# EAGLE design tester (EAGLE 7.6.0)
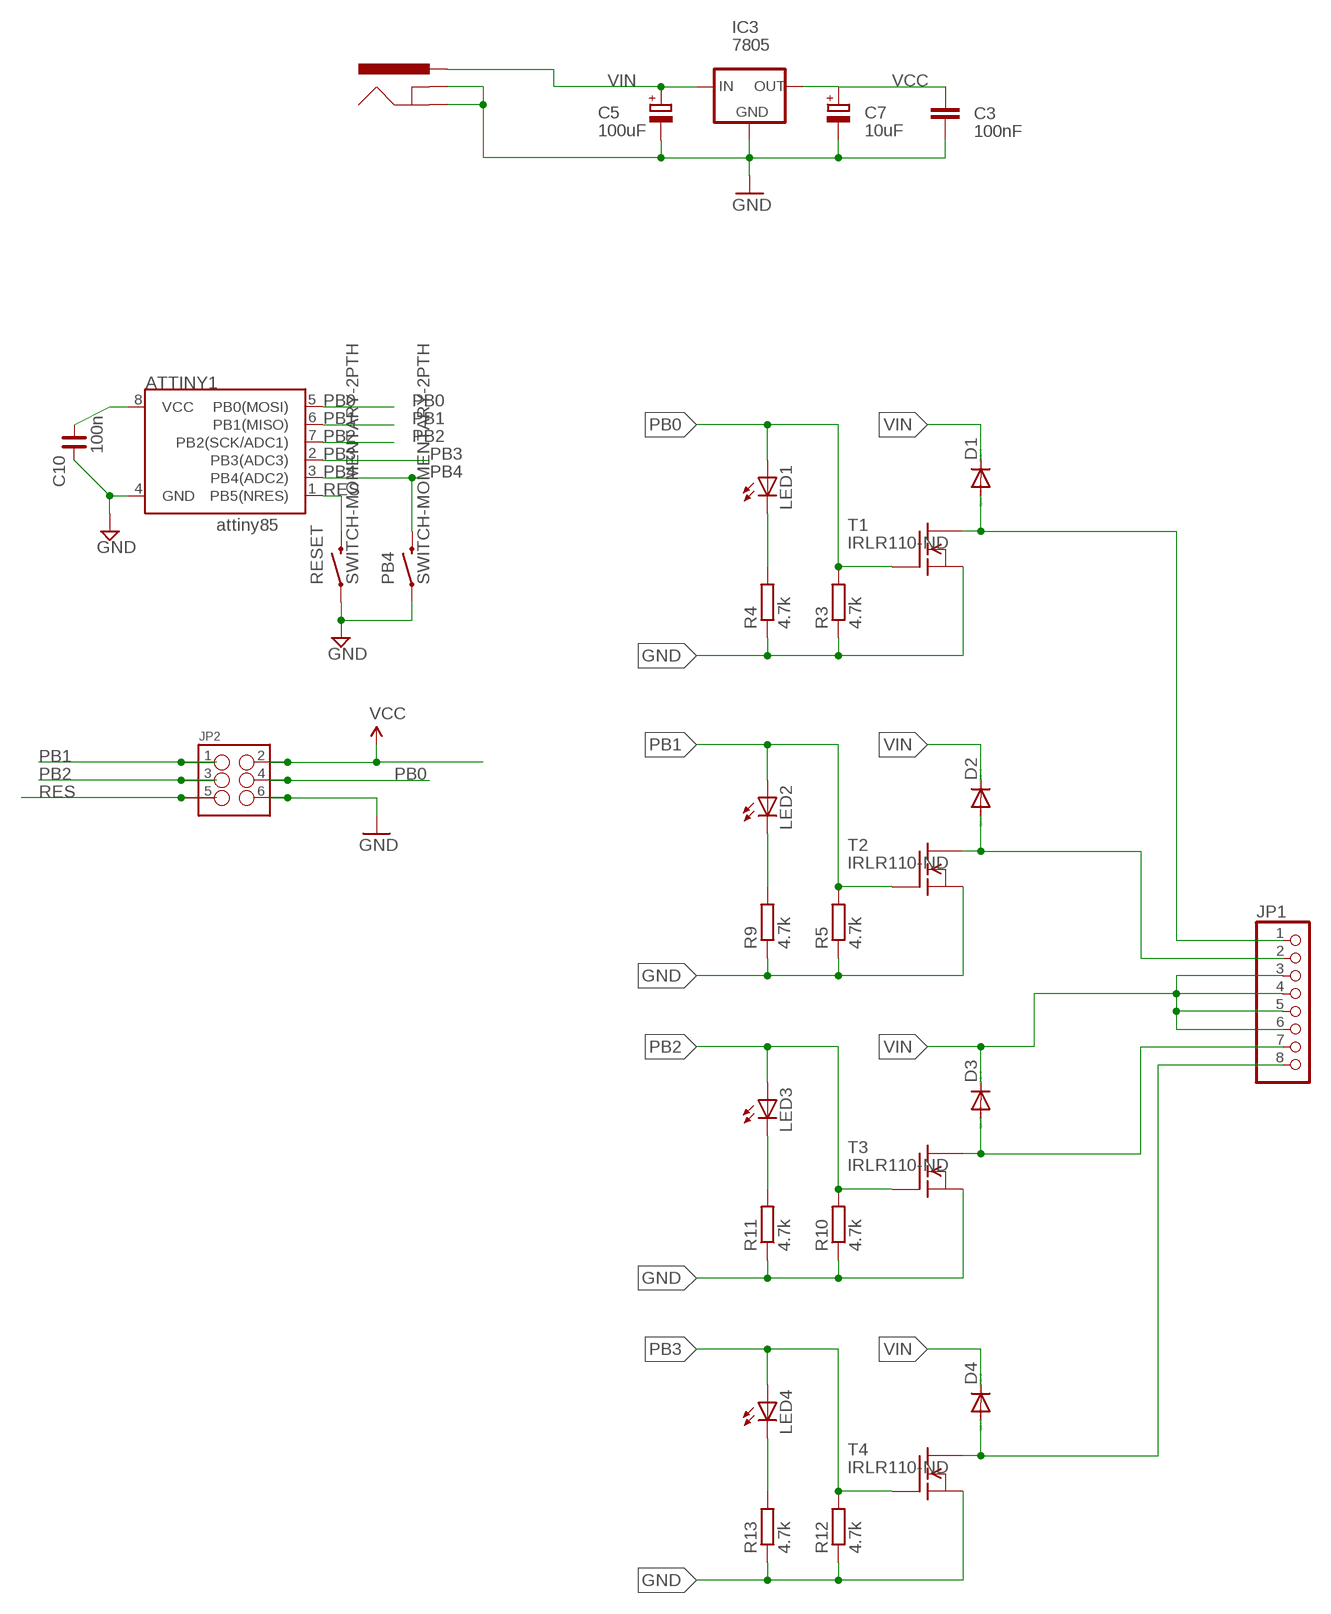
[diagram p0: schematic, sheet 1]

## Parts
ATTINY1  ATTINY45DIP8  [DIP08]
C3  100nF  C-EU050-024X044  [C050-024X044]
C5  100uF  CPOL-EUE2.5-5  [E2,5-5]
C7  10uF  CPOL-EUE2.5-5  [E2,5-5]
C10  100n  C_0603  [C0603]
D1  DIODE-DO214AC  [DO214AC]
D2  DIODE-DO214AC  [DO214AC]
D3  DIODE-DO214AC  [DO214AC]
D4  DIODE-DO214AC  [DO214AC]
IC3  7805  78XXL  [78XXL]
J16  POWER_JACKPTH  [POWER_JACK_PTH]
JP1  PINHD-1X8  [1X08]
JP2  M03X2NO_SILK  [2X3-NS@1]
LED1  LEDCHIPLED_1206  [CHIPLED_1206]
LED2  LEDCHIPLED_1206  [CHIPLED_1206]
LED3  LEDCHIPLED_1206  [CHIPLED_1206]
LED4  LEDCHIPLED_1206  [CHIPLED_1206]
PB4  SWITCH-MOMENTARY-2PTH  [TACTILE-PTH]
R3  4.7k  R-EU_R0603  [R0603]
R4  4.7k  R-EU_R0603  [R0603]
R5  4.7k  R-EU_R0603  [R0603]
R9  4.7k  R-EU_R0603  [R0603]
R10  4.7k  R-EU_R0603  [R0603]
R11  4.7k  R-EU_R0603  [R0603]
R12  4.7k  R-EU_R0603  [R0603]
R13  4.7k  R-EU_R0603  [R0603]
RESET  SWITCH-MOMENTARY-2PTH  [TACTILE-PTH]
T1  IRLR110-ND  [TO252]
T2  IRLR110-ND  [TO252]
T3  IRLR110-ND  [TO252]
T4  IRLR110-ND  [TO252]

## Nets
GND [GND]: ATTINY1.4(GND) C3.2 C5.- C7.- C10.2 IC3.GND J16.GND J16.GNDBREAK JP2.6 PB4.1 R3.1 R4.1 R5.1 R9.1 R10.1 R11.1 R12.1 R13.1 RESET.1 T1.2(S) T2.2(S) T3.2(S) T4.2(S)
N$3: LED1.C R4.2
N$4: D2.A JP1.2 T2.3(D)
N$6: D1.A JP1.1 T1.3(D)
N$7: D3.A JP1.7 T3.3(D)
N$8: LED2.C R9.2
N$9: D4.A JP1.8 T4.3(D)
N$12: LED3.C R11.2
N$19: LED4.C R13.2
PB0: ATTINY1.5(PB0(MOSI)) JP2.4 LED1.A R3.2 T1.1(G)
PB1: ATTINY1.6(PB1(MISO)) JP2.1 LED2.A R5.2 T2.1(G)
PB2: ATTINY1.7(PB2(SCK/ADC1)) JP2.3 LED3.A R10.2 T3.1(G)
PB3: ATTINY1.2(PB3(ADC3)) LED4.A R12.2 T4.1(G)
PB4: ATTINY1.3(PB4(ADC2)) PB4.3
RES: ATTINY1.1(PB5(NRES)) JP2.5 RESET.3
VCC [pwr]: ATTINY1.8(VCC) C3.1 C7.+ C10.1 IC3.OUT JP2.2
VIN [pwr]: C5.+ D1.C D2.C D3.C D4.C IC3.IN J16.PWR JP1.3 JP1.4 JP1.5 JP1.6

## Notes on the sheet
- attiny85

## Library data of the parts
ATTINY1 = SparkFun:ATTINY45: Atmel ATTiny45
C3 = rcl:C-EU: CAPACITOR, European symbol
C5 C7 = rcl:CPOL-EU: POLARIZED CAPACITOR, European symbol
C10 = rc-master-smd:C_: NON-POLARIZED CAP
D1-D4 = diode:DIODE-: DIODE
IC3 = v-reg:78XXL: VOLTAGE REGULATOR
J16 = SparkFun:POWER_JACK: Power Jack This is the standard 5.5mm barrel jack for power. The PTH is the most common, proven, reliable, footprint. All others are experimental. The Slot footprint only works if the mill layer is transmitted to the PCB fab house so be warned. Spark Fun Electronics SKU : PRT-00119. Mating wall wart : TOL-00298 (and others)
JP1 = pinhead:PINHD-1X8: PIN HEADER
JP2 = SparkFun-Connectors:M03X2: 2x3 .1" header. Shrouded, with keying- CONN-10681 SMT- CONN-11415 Pogo pins- HW-11044
LED1-LED4 = led:LED: LED OSRAM: - CHIPLED LG R971, LG N971, LY N971, LG Q971, LY Q971, LO R971, LY R971 LH N974, LH R974 LS Q976, LO Q976, LY Q976 LO Q996 - Hyper CHIPLED LW Q18S LB Q993, LB Q99A, LB R99A - SideLED LS A670, LO A670, LY A670, LG A670, LP A670 LB A673, LV A673, LT A673, LW A673 LH A674 LY A675 LS A676, LA A676, LO A676, LY A676, LW A676 LS A679, LY A679, LG A679 - Hyper Micro SIDELED® LS Y876, LA Y876, LO Y876, LY Y876 LT Y87S - SmartLED LW L88C, LW L88S LB L89C, LB L89S, LG L890 LS L89K, LO L89K, LY L89K LS L896, LA L896, LO L896, LY L896 - TOPLED LS T670, LO T670, LY T670, LG T670, LP T670 LSG T670, LSP T670, LSY T670, LOP T670, LYG T670 LG T671, LOG T671, LSG T671 LB T673, LV T673, LT T673, LW T673 LH T674 LS T676, LA T676, LO T676, LY T676, LB T676, LH T676, LSB T676, LW T676 LB T67C, LV T67C, LT T67C, LS T67K, LO T67K, LY T67K, LW E67C LS E67B, LA E67B, LO E67B, LY E67B, LB E67C, LV E67C, LT E67C LW T67C LS T679, LY T679, LG T679 LS T770, LO T770, LY T770, LG T770, LP T770 LB T773, LV T773, LT T773, LW T773 LH T774 LS E675, LA E675, LY E675, LS T675 LS T776, LA T776, LO T776, LY T776, LB T776 LHGB T686 LT T68C, LB T68C - Hyper Mini TOPLED® LB M676 - Mini TOPLED Santana® LG M470 LS M47K, LO M47K, LY M47K Source: http://www.osram.convergy.de LUXEON: - LUMILED® LXK2-PW12-R00, LXK2-PW12-S00, LXK2-PW14-U00, LXK2-PW14-V00 LXK2-PM12-R00, LXK2-PM12-S00, LXK2-PM14-U00 LXK2-PE12-Q00, LXK2-PE12-R00, LXK2-PE12-S00, LXK2-PE14-T00, LXK2-PE14-U00 LXK2-PB12-K00, LXK2-PB12-L00, LXK2-PB12-M00, LXK2-PB14-N00, LXK2-PB14-P00, LXK2-PB14-Q00 LXK2-PR12-L00, LXK2-PR12-M00, LXK2-PR14-Q00, LXK2-PR14-R00 LXK2-PD12-Q00, LXK2-PD12-R00, LXK2-PD12-S00 LXK2-PH12-R00, LXK2-PH12-S00 LXK2-PL12-P00, LXK2-PL12-Q00, LXK2-PL12-R00 Source: www.luxeon.com KINGBRIGHT: KA-3528ASYC Source: www.kingbright.com
PB4 RESET = SparkFun:SWITCH-MOMENTARY-2
R3-R5 R9-R13 = rcl:R-EU_: RESISTOR, European symbol
T1-T4 = JVN:IRLR110-ND

## Net classes
0 default: width 0.229 mm, drill 0.381 mm, clearance 0.254 mm
1 GND: width 0.508 mm, drill 0.381 mm, clearance 0.254 mm
2 pwr: width 0.33 mm, drill 0.381 mm, clearance 0.254 mm

## Board
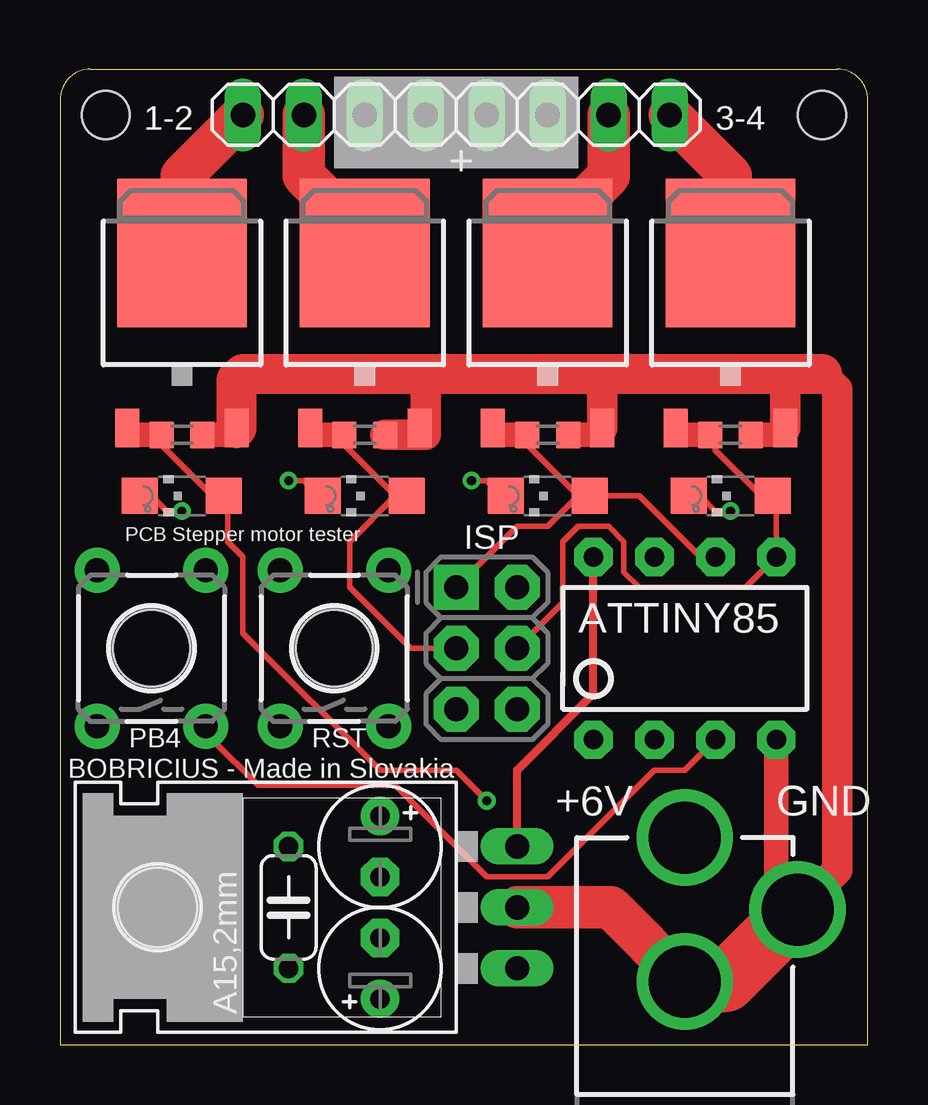
[diagram p1: board, top side]
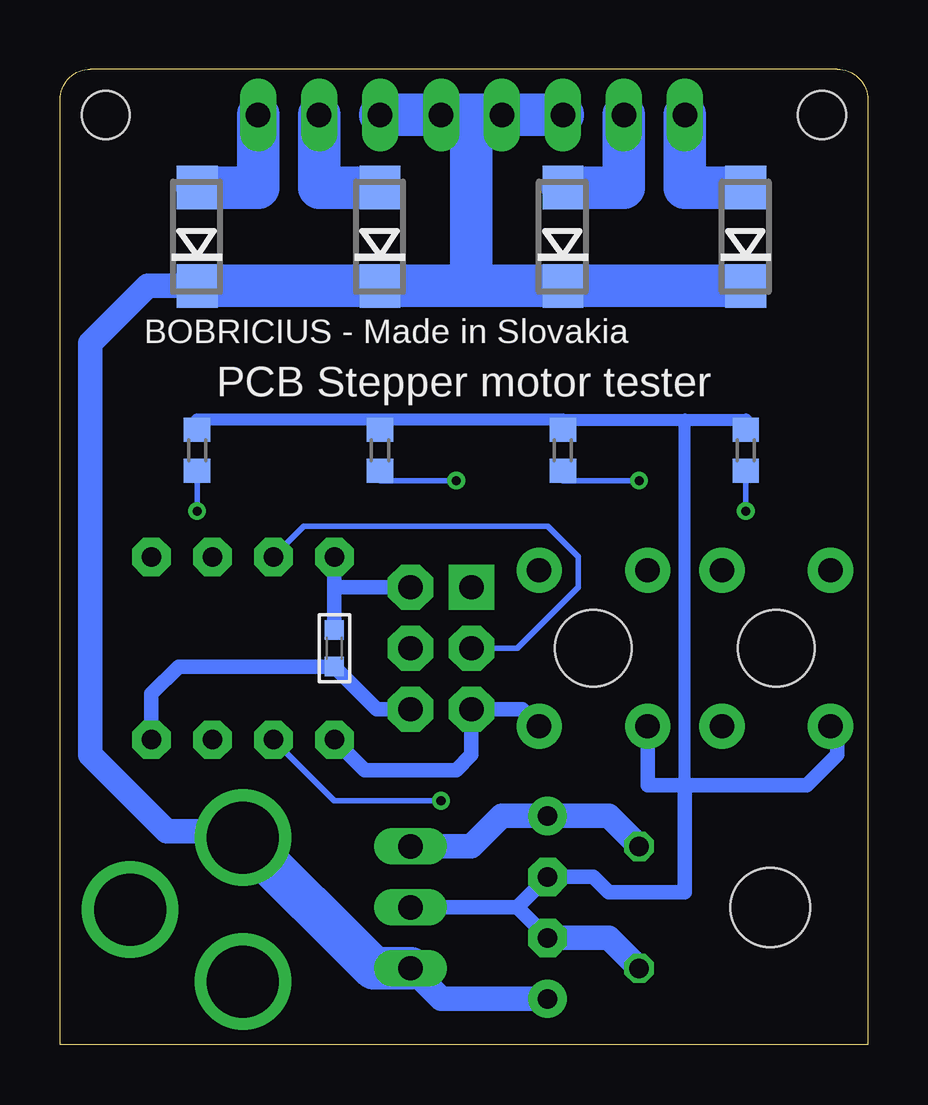
[diagram p2: board, bottom side, seen from below]

Size 33.65 x 40.64 mm. Coordinates in mm from the lower left corner, seen from the top.
Outline: 33.65,0 33.65,39.37 arc90 32.38,40.64 1.27,40.64 arc90 0,39.37 0,0 33.65,0
Copper layers (1*16): Top 0.0356mm / dielectric 1.5011mm / Bottom 0.0356mm
Design rules "LaenPCBOrder *": minimum track width 6mil, minimum drill 13mil, track to track 6mil, track to pad 6mil, pad to pad 6mil, via to via 6mil, smd to smd 6mil, copper to edge 15mil, drill to drill 6mil, minimum pad ring 7mil, minimum via ring 7mil, stop-mask expansion 4mil, vias tented up to drill 30mil, thermal gap 10mil
Holes 2 mm at 31.75,38.73 1.9,38.73
Holes 3.2 mm at 3.81,16.51 11.43,16.51

### Footprints (pad centres in the part's own frame; a part is rotated, then mirrored left to right if it is on the bottom)
DIP08 = drill 0.813 pad 1.6 octagon: 1 -3.81,-3.81; 2 -1.27,-3.81; 3 1.27,-3.81; 4 3.81,-3.81; 5 3.81,3.81; 6 1.27,3.81; 7 -1.27,3.81; 8 -3.81,3.81
C050-024X044 = drill 0.813 octagon: 1 -2.54,0; 2 2.54,0
E2,5-5 = drill 0.813 pad 1.6: + -1.27,0 | drill 0.813 pad 1.6 octagon: - 1.27,0
C0603 = smd 0.8 x 0.8: 1 -0.762,0; 2 0.762,0
DO214AC = smd 1.8 x 1.7: A 2.05,0; C -2.05,0
78XXL = drill 1.016 long: GND 0,-3.81; IN -2.54,-3.81; OUT 2.54,-3.81 | hole 3.302: 0,11.176
POWER_JACK_PTH = drill 2.997: GND 0,7.7; GNDBREAK 4.7,10.7; PWR 0,13.7
1X08 = drill 1.016 long: 1 -8.89,0; 2 -6.35,0; 3 -3.81,0; 4 -1.27,0; 5 1.27,0; 6 3.81,0; 7 6.35,0; 8 8.89,0
2X3-NS@1 = drill 1.016 pad 1.88 square: 1 -2.54,-1.27 | drill 1.016 pad 1.88 octagon: 2 -2.54,1.27; 3 0,-1.27; 4 0,1.27; 5 2.54,-1.27; 6 2.54,1.27
CHIPLED_1206 = smd 1.5 x 1.5: A 0,-1.75; C 0,1.75
TACTILE-PTH = drill 1.016 pad 1.88: 1 -3.251,2.261; 2 3.251,2.261; 3 -3.251,-2.261; 4 3.251,-2.261
R0603 = smd 1 x 1.1: 1 -0.85,0; 2 0.85,0
TO252 = smd 1 x 1.6: 1 -2.28,-4.8; 2 2.28,-4.8 | smd 5.4 x 6.2: 3 0,2.5

### Placement (x,y rotation side)
ATTINY1  26.04,16.51 0 top
C3  9.52,5.71 270 top
C5  13.34,3.17 90 top
C7  13.34,8.25 270 top
C10  22.23,16.51 270 bottom
D1  27.94,33.65 90 bottom
D2  20.32,33.65 90 bottom
D3  12.7,33.65 90 bottom
D4  5.08,33.65 90 bottom
IC3  15.24,5.71 90 top
J16  26.04,-5.08 0 top
JP1  16.51,38.73 180 top
JP2  17.78,16.51 270 top
LED1  27.94,22.86 90 top
LED2  20.32,22.86 90 top
LED3  12.7,22.86 90 top
LED4  5.08,22.86 90 top
PB4  3.81,16.51 90 top
R3  27.94,25.4 180 top
R4  27.94,24.76 270 bottom
R5  20.32,25.4 180 top
R9  20.32,24.76 270 bottom
R10  12.7,25.4 180 top
R11  12.7,24.76 270 bottom
R12  5.08,25.4 180 top
R13  5.08,24.76 270 bottom
RESET  11.43,16.51 90 top
T1  27.94,30.48 0 top
T2  20.32,30.48 0 top
T3  12.7,30.48 0 top
T4  5.08,30.48 0 top

### Tracks (layer width: path | path; a pad name or v marks a point on that pad's centre or on a via)
GND
  Top 1.016: R12.1 7.08,25.4 T4.2 | R10.1 14.7,25.4 T3.2 | R5.1 22.32,25.4 T2.2 | R3.1 29.94,25.4 T1.2 | ATTINY1.4 29.84,6.51 J16.GNDBREAK
  Top 1.27: 31.75,27.94 32.38,27.3 32.38,7.27 J16.GNDBREAK | T1.2 30.22,27.56 29.84,27.94 | T2.2 22.6,27.68 22.86,27.94 | R10.1 15.24,25.4 15.24,27.94
  Top 1.676: T4.2 7.36,27.68 7.62,27.94 15.24,27.94 22.86,27.94 29.84,27.94 31.75,27.94
  Top 1.778: IC3.GND 22.94,5.71 J16.GND
  Top 2.54: J16.GND 27.73,2.62 J16.GNDBREAK
  Bottom 0.508: 12.7,26.04 7.62,26.04 | 7.62,26.04 5.08,26.04 R13.1 | 12.7,26.04 20.32,26.04 | 12.7,26.04 R11.1 | 20.32,26.04 27.94,26.04 R4.1 | 20.32,26.04 R9.1 | 7.62,10.79 7.62,26.04
  Bottom 0.61: JP2.6 20.45,13.97 C10.2 28.7,15.75 29.84,14.6 ATTINY1.4 | IC3.GND 14.6,5.71 | 14.6,5.71 C5.- | 14.6,5.71 C7.- 11.43,6.98 10.79,6.35 7.62,6.35 7.62,10.79 | 7.62,10.79 9.17,10.79 RESET.1 | PB4.1 1.27,13.26 | 1.27,13.26 1.27,13.34 | 1.27,13.26 1.27,12.06 2.54,10.79 7.62,10.79
  Bottom 1.016: C5.- 10.79,4.45 C3.2
N$3  (via drill 0.38)
  Top 0.229: v27.94,22.22 27.3,22.22 26.67,22.86 LED1.C
  Bottom 0.229: v27.94,22.22 R4.2
N$4
  Top 1.778: T2.3 20.32,33.65 22.86,36.2 JP1.2
  Bottom 1.778: D2.A 22.86,35.7 JP1.2
N$6
  Top 1.778: T1.3 27.94,36.2 JP1.1
  Bottom 1.778: D1.A 25.4,35.7 JP1.1
N$7
  Top 1.778: T3.3 12.7,33.65 10.16,36.2 JP1.7
  Bottom 1.778: D3.A 10.16,35.7 JP1.7
N$8  (via drill 0.38)
  Top 0.229: v17.15,23.49 17.78,23.49 18.41,22.86 LED2.C
  Bottom 0.229: v17.15,23.49 20.32,23.49 R9.2
N$9
  Top 1.778: T4.3 5.08,36.2 JP1.8
  Bottom 1.778: D4.A 7.62,35.7 JP1.8
N$12  (via drill 0.38)
  Top 0.229: v9.52,23.49 10.16,23.49 10.79,22.86 LED3.C
  Bottom 0.229: v9.52,23.49 12.7,23.49 R11.2
N$19  (via drill 0.38)
  Top 0.229: v5.08,22.22 4.45,22.22 3.81,22.86 LED4.C
  Bottom 0.229: v5.08,22.22 R13.2
PB0
  Top 0.229: R3.2 27.3,25.4 27.3,24.76 29.21,22.86 LED1.A 29.84,22.86 ATTINY1.5 28.57,19.05 24.13,19.05 23.49,19.68 23.49,20.95 22.86,21.59 21.59,21.59 20.95,20.95 20.95,18.41 JP2.4
  Top 1.016: R3.2 25.94,25.4 T1.1
PB1
  Top 0.229: 19.05,25.4 21.59,22.86 | ATTINY1.6 26.67,20.32 24.13,22.86 LED2.A 21.59,22.86 | JP2.1 19.05,21.59 20.32,21.59 21.59,22.86
  Top 1.016: R5.2 19.05,25.4 18.32,25.4 T2.1
PB2
  Top 0.229: 11.43,25.4 13.97,22.86 | 13.97,22.86 12.06,20.95 12.06,19.05 14.6,16.51 JP2.3 | 13.97,22.86 LED3.A
  Top 1.016: R10.2 11.43,25.4 10.7,25.4 T3.1
  Bottom 0.229: ATTINY1.7 23.49,21.59 13.34,21.59 12.06,20.32 12.06,19.05 14.6,16.51 JP2.3
PB3  (via drill 0.38)
  Top 0.229: 3.81,25.4 6.35,22.86 LED4.A 6.98,22.86 6.98,20.95 7.62,20.32 7.62,17.14 13.34,11.43 16.51,11.43 v17.78,10.16
  Top 1.016: R12.2 3.81,25.4 3.08,25.4 T4.1
  Bottom 0.229: v17.78,10.16 22.23,10.16 ATTINY1.2
PB4
  Top 0.229: ATTINY1.3 26.04,11.43 24.76,11.43 20.32,6.98 17.78,6.98 13.97,10.79 8.26,10.79 6.35,12.7 PB4.3
RES
  Bottom 0.61: RESET.3 14.4,13.97 JP2.5 16.51,12.06 17.15,11.43 20.95,11.43 ATTINY1.1
VCC
  Top 0.33: ATTINY1.8 22.23,14.6 19.05,11.43 IC3.OUT
  Bottom 0.61: C10.1 22.23,19.05 | 22.23,19.05 ATTINY1.8 | JP2.2 22.23,19.05
  Bottom 1.016: IC3.OUT 16.51,8.25 15.24,9.52 C7.+ 10.79,9.52 C3.1
VIN
  Bottom 1.016: C5.+ 17.78,1.9 IC3.IN | D1.C 29.99,31.6 32.38,29.21 32.38,12.06 29.21,8.89 26.3,8.89 J16.PWR
  Bottom 1.778: D1.C D2.C 16.51,31.6 | 16.51,31.6 D3.C D4.C | JP1.6 JP1.5 16.51,38.73 | 16.51,38.73 JP1.4 JP1.3 | 16.51,31.6 16.51,38.73 | IC3.IN 20.59,3.17 J16.PWR

### Text on the board
tNames: 1-2 | 3-4 | + | PCB Stepper motor tester | ISP | ATTINY85 | PB4 | RST | BOBRICIUS - Made in Slovakia | +6V | GND
bNames: BOBRICIUS - Made in Slovakia | PCB Stepper motor tester